# EAGLE schematic blockDiagram (EAGLE 7.1.0)
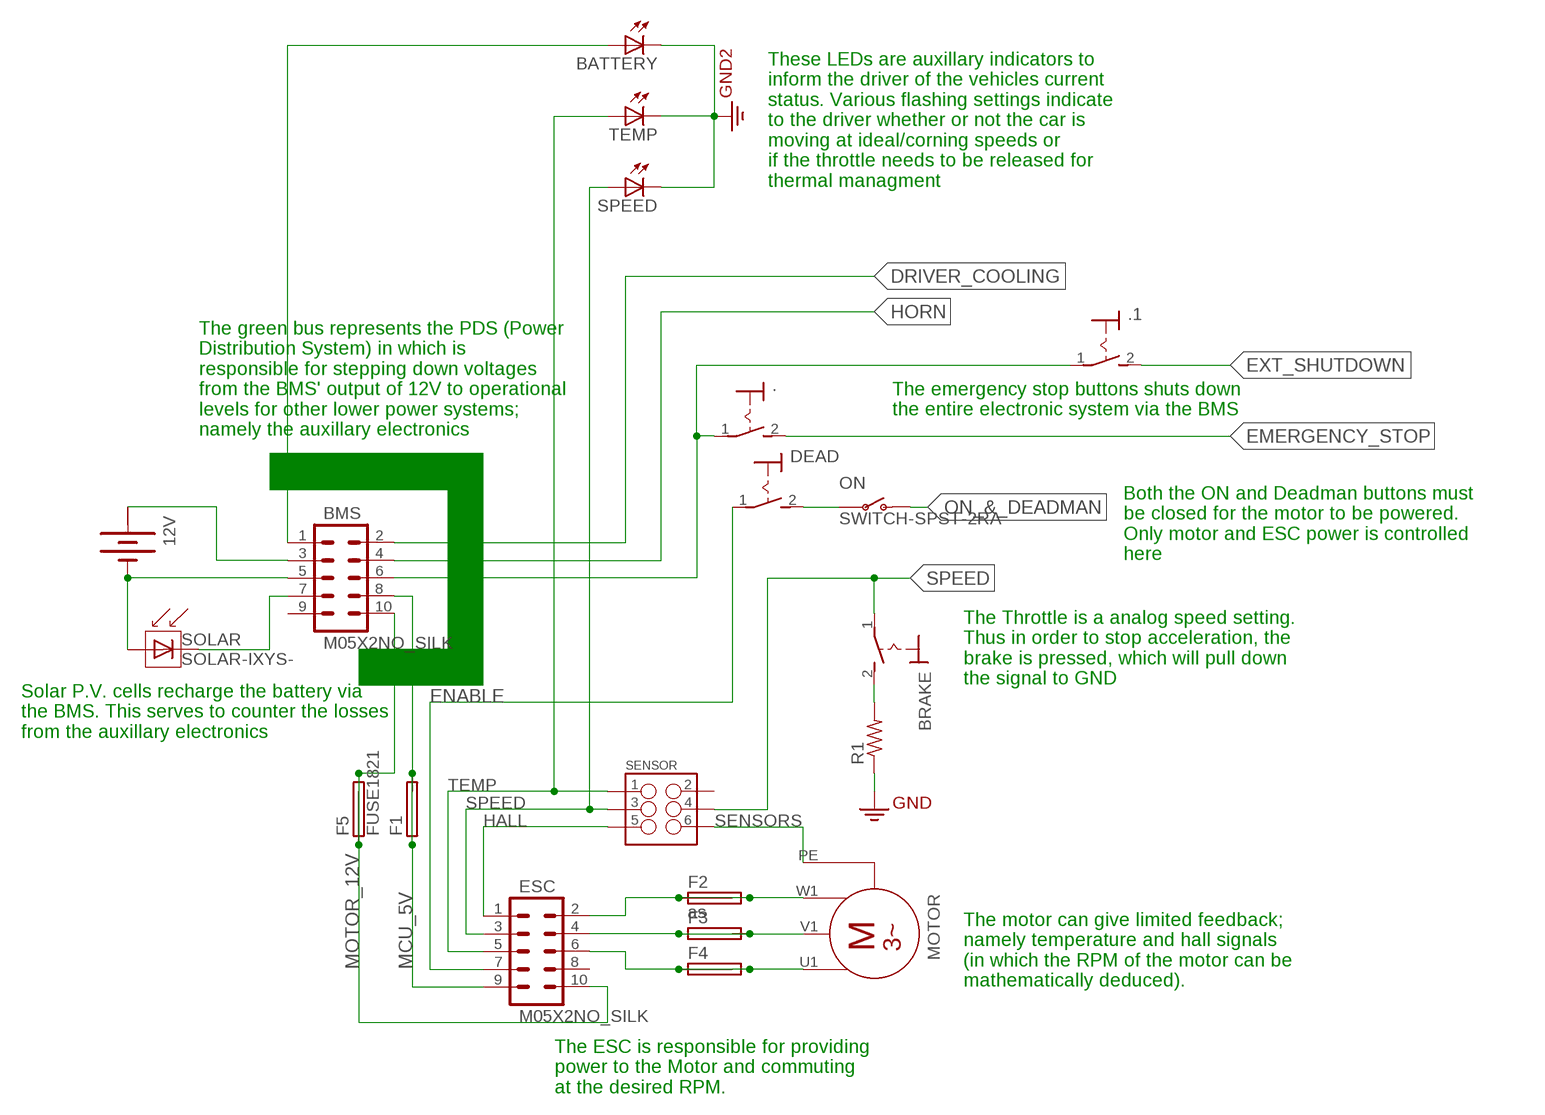
[diagram p0: schematic, sheet 1]

## Parts
12V  BATTERY  [BATTERY]
.  MS243  [MS243]
.1  MS243  [MS243]
BATTERY  LED1206  [LED-1206]
BMS  M05X2NO_SILK  [2X5_NOSILK]
BRAKE  MS243  [MS243]
DEAD  MS243  [MS243]
ESC  M05X2NO_SILK  [2X5_NOSILK]
F1  KS9V  [KS9V]
F2  as  KS9V  [KS9V]
F3  KS9V  [KS9V]
F4  KS9V  [KS9V]
F5  FUSE1821  [FUSE_HOLDER_MENTOR-1821]
MOTOR  MOTOR_3-POL_PE  [MOTOR_3-POL_PE]
ON  SWITCH-SPST-2RA  [R_SW_TH]
R1  R-US_0204/2V  [0204V]
SENSOR  M03X2  [2X3_SMD]
SOLAR  SOLAR-IXYS-  [SOLARBIT-12X1]
SPEED  LED1206  [LED-1206]
TEMP  LED1206  [LED-1206]

## Nets
3.3V: BATTERY.C R1.1 SPEED.C TEMP.C ; supply symbol labelled GND2
DRIVER_COOLING: BMS.2
EMERGENCY_STOP: ..2(S)
ENABLE: DEAD.1(P) ESC.7
EXT_SHUTDOWN: .1.2(S)
HALL: ESC.1 SENSOR.5
HORN: BMS.4
MCU_5V: BMS.8 ESC.9 F1.1 F1.2
MOTOR_12V: BMS.10 ESC.10 F5.A F5.B
N$1: 12V.- BMS.5 SOLAR.+(A)
N$2: 12V.+ BMS.3
N$3: BMS.7 SOLAR.-(C)
N$4: ESC.2 F2.1 F2.2 MOTOR.W1
N$7: BRAKE.2(S) R1.2
N$8: DEAD.2(S) ON.P$4(P)
N$9: ESC.4 F3.1 F3.2 MOTOR.V1
N$10: .1.1(P) ..1(P) BMS.6
N$11: BATTERY.A BMS.1
ON_&_DEADMAN: ON.P$3(O)
SENSORS: MOTOR.PE SENSOR.6
SPEED: BRAKE.1(P) ESC.3 SENSOR.3 SENSOR.4 SPEED.A
TEMP: ESC.5 SENSOR.1 TEMP.A
TEST: ESC.6 F4.1 F4.2 MOTOR.U1
Unconnected: BMS.9 ESC.8 SENSOR.2

## Notes on the sheet
- These LEDs are auxillary indicators to 
  inform the driver of the vehicles current
  status. Various flashing settings indicate
  to the driver whether or not the car is
  moving at ideal/corning speeds or 
  if the throttle needs to be released for 
  thermal managment
- The green bus represents the PDS (Power
  Distribution System) in which is
  responsible for stepping down voltages
  from the BMS' output of 12V to operational
  levels for other lower power systems;
  namely the auxillary electronics
- The emergency stop buttons shuts down
  the entire electronic system via the BMS
- Both the ON and Deadman buttons must
  be closed for the motor to be powered.
  Only motor and ESC power is controlled
  here
- The Throttle is a analog speed setting.
  Thus in order to stop acceleration, the
  brake is pressed, which will pull down
  the signal to GND
- Solar P.V. cells recharge the battery via
  the BMS. This serves to counter the losses
  from the auxillary electronics
- The motor can give limited feedback;
  namely temperature and hall signals 
  (in which the RPM of the motor can be
  mathematically deduced).
- The ESC is responsible for providing
  power to the Motor and commuting
  at the desired RPM.

## Power pins joined to a net without a drawn wire
+: 12V.+@1(+)

## Library data of the parts
12V = special:BATTERY: BATTERY
. .1 BRAKE DEAD = switch:MS243: TOGGLE SWITCH
BATTERY SPEED TEMP = LilyPad-Wearables:LED: LEDs Standard schematic elements and footprints for 5mm, 3mm, 1206, and 0603 sized LEDs. 5mm - Spark Fun Electronics SKU : Comp-SBL
BMS ESC = SparkFun-Connectors:M05X2: Header 5x2 Standard 10-pin dual row 0.1" header. Commonly used with AVR-ISP. Use with Spark Fun Electronics SKU: PRT-00778
F1-F4 = fuse:KS9V: FUSE HOLDER CS, Schukat; OC_FARNELL: unknown; OC_NEWARK: unknown
F5 = fuse:FUSE: Fuse; OC_FARNELL: unknown; OC_NEWARK: unknown
MOTOR = e-motoren:MOTOR_3-POL_PE: 3-Phasen-Motor mit PE
ON = SparkFun-Electromechanical:SWITCH-SPST-2
R1 = resistor:R-US_: RESISTOR, American symbol
SENSOR = SparkFun-Connectors:M03X2: 2x3 .1" header. Shrouded, with keying- CONN-10681 SMT- CONN-11415 Pogo pins- HW-11044; PROD_ID: CONN-11290
SOLAR = SparkFun-Sensors:SOLAR-IXYS